# Altium schematic sheet Smart_Reclyce_Bin.SchDoc
size A4
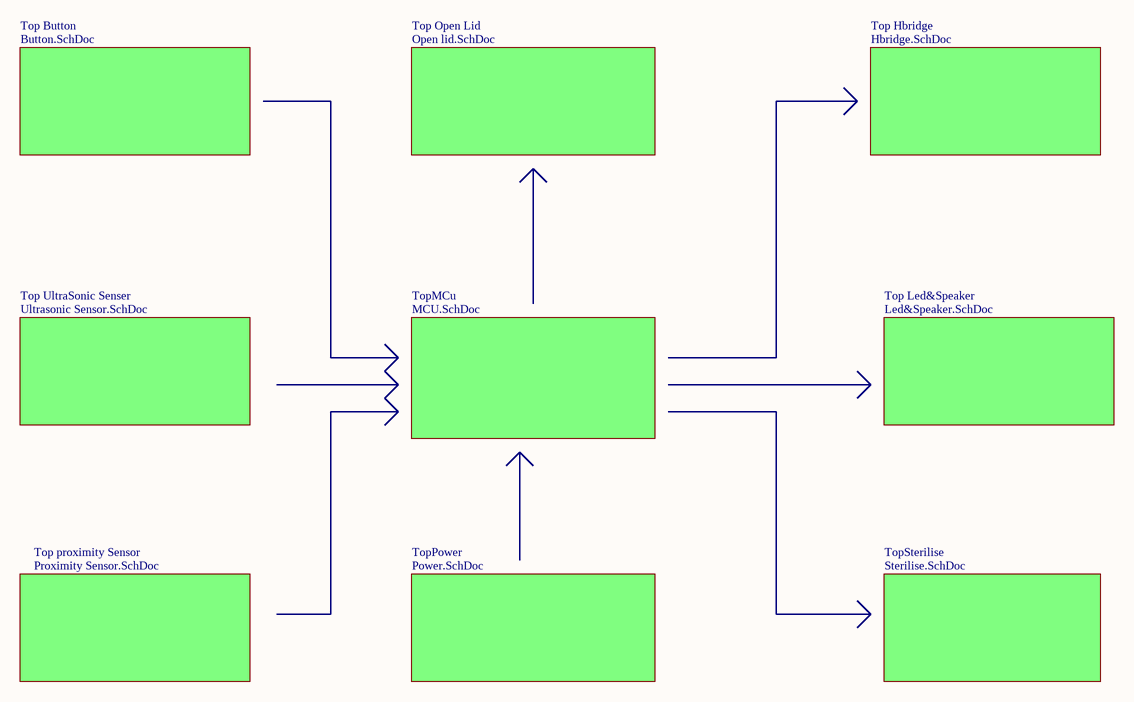
[diagram p0: Smart_Reclyce_Bin.SchDoc]

## Sub-sheets
Top Button = Button.SchDoc: no entries
Top Hbridge = Hbridge.SchDoc: no entries
Top Led&Speaker = Led&Speaker.SchDoc: no entries
Top Open Lid = Open lid.SchDoc: no entries
Top proximity Sensor = Proximity Sensor.SchDoc: no entries
Top UltraSonic Senser = Ultrasonic Sensor.SchDoc: no entries
TopMCu = MCU.SchDoc: no entries
TopPower = Power.SchDoc: no entries
TopSterilise = Sterilise.SchDoc: no entries